# EAGLE design MicroMod-Testing-CarrierBoard (EAGLE 9.5.2)
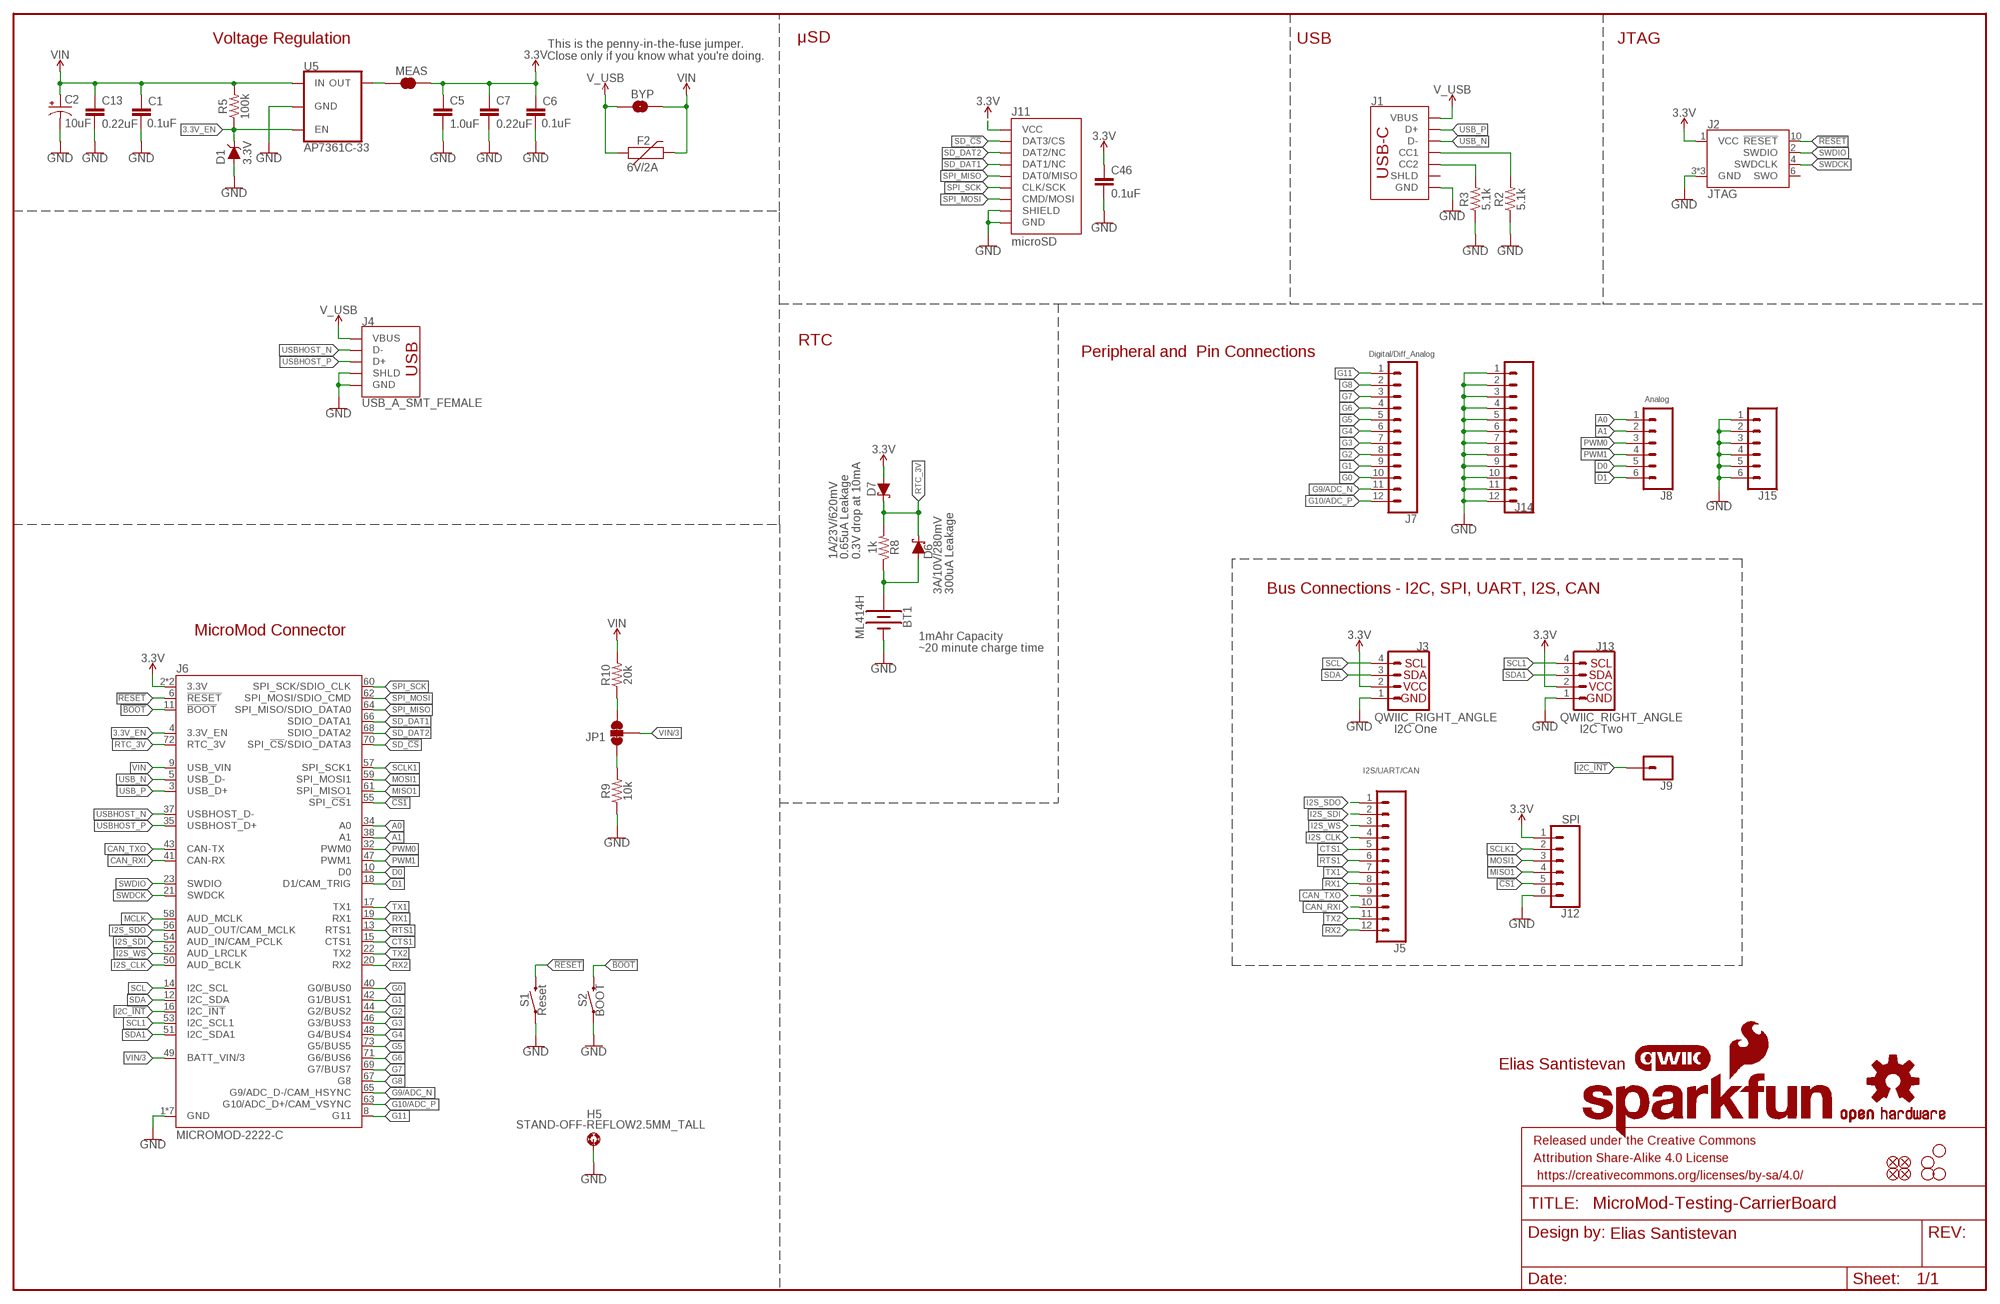
[diagram p0: schematic, sheet 1]

## Parts
BT1  ML414H  ML414H_IV01E_BATTERY  [ML414H_IV01E]
BYP  JUMPER-SMT_2_NO_SILK  [SMT-JUMPER_2_NO_SILK]
C1  0.1uF  0.1UF-0603-25V-(+80/-20%)  [0603]
C2  10uF  10UF-POLAR-EIA3216-16V-10%(TANT)  [EIA3216]
C5  1.0uF  1.0UF-0603-16V-10%  [0603]
C6  0.1uF  0.1UF-0603-25V-(+80/-20%)  [0603]
C7  0.22uF  0.22UF-0603-25V-10%  [0603]
C13  0.22uF  0.22UF-0603-25V-10%  [0603]
C46  0.1uF  0.1UF-0603-25V-(+80/-20%)  [0603]
D1  3.3V  DIODE-ZENER-MM3Z3V3T1G  [SOD-323]
D6  3A/10V/280mV  DIODE-SCHOTTKY-BAT60A  [SOD-323]
D7  1A/23V/620mV  DIODE-SCHOTTKY-BAT20J  [SOD-323]
F2  6V/2A  PPTC_6V2A  [1210]
FD1  FIDUCIALUFIDUCIAL  [FIDUCIAL-MICRO]
FD2  FIDUCIALUFIDUCIAL  [FIDUCIAL-MICRO]
FD3  FIDUCIALUFIDUCIAL  [FIDUCIAL-MICRO]
FD4  FIDUCIALUFIDUCIAL  [FIDUCIAL-MICRO]
FRAME1  FRAME-LEDGER  [CREATIVE_COMMONS]
H1  STAND-OFF  [STAND-OFF]
H2  STAND-OFF  [STAND-OFF]
H3  STAND-OFF  [STAND-OFF]
H4  STAND-OFF  [STAND-OFF]
H5  STAND-OFF-REFLOW2.5MM_TALL  [STAND-OFF-REFLOW-M2.5]
J1  USB_C_2-LAYER_PADS  [USB-C-16P-2LAYER-PADS]
J2  JTAG  CORTEX_JTAG_DEBUG_MINIMUM_PTH  [2X5-PTH-1.27MM]
J3  QWIIC_RIGHT_ANGLE  QWIIC_CONNECTORJS-1MM  [JST04_1MM_RA]
J4  USB_A_SMT_FEMALE  [USB-A-S-SILK-FEMALE]
J5  CONN_12NO_SILK  [1X12_NO_SILK]
J6  MICROMOD-2222-C  [M.2-CONNECTOR-E]
J7  CONN_12NO_SILK  [1X12_NO_SILK]
J8  Dedicated  CONN_06NO_SILK_NO_POP  [1X06_NO_SILK]
J9  CONN_01PTH_NO_SILK_YES_STOP  [1X01_NO_SILK]
J11  microSD  MICRO-SD-SDIOPUSH-PUSH  [MICRO-SD-SOCKET]
J12  SPI  CONN_06NO_SILK_NO_POP  [1X06_NO_SILK]
J13  QWIIC_RIGHT_ANGLE  QWIIC_CONNECTORJS-1MM  [JST04_1MM_RA]
J14  CONN_12NO_SILK  [1X12_NO_SILK]
J15  Dedicated  CONN_06NO_SILK_NO_POP  [1X06_NO_SILK]
JP1  JUMPER-SMT_3_2-NC_TRACE_SILK  [SMT-JUMPER_3_2-NC_TRACE_SILK]
LOGO1  SFE_LOGO_NAME_FLAME.1_INCH  [SFE_LOGO_NAME_FLAME_.1]
LOGO2  QWIIC_LOGO_CONNECTOR  [QWIIC_5.5MM]
LOGO3  OSHW-LOGOMINI  [OSHW-LOGO-MINI]
MEAS  JUMPER-COMBO_2_NC_TRACE  [COMBO-JUMPER_2_NC_TRACE]
R2  5.1k  5.1KOHM5.1KOHM-0603-1/10W-1%  [0603]
R3  5.1k  5.1KOHM5.1KOHM-0603-1/10W-1%  [0603]
R5  100k  100KOHM-0603-1/10W-1%  [0603]
R8  1k  1KOHM-0603-1/10W-1%  [0603]
R9  10k  10KOHM-0603-1/10W-1%  [0603]
R10  20k  20KOHM-0603-1/10W-1%  [0603]
S1  Reset  MOMENTARY-SWITCH-SPST-SMD-5.2-TALL-REDUNDANT  [TACTILE_SWITCH_SMD_5.2MM]
S2  BOOT  MOMENTARY-SWITCH-SPST-SMD-5.2-TALL-REDUNDANT  [TACTILE_SWITCH_SMD_5.2MM]
U5  AP7361C-33  AP7361C-33FGEUDFN-8  [UDFN-8]

## Nets
3.3V: C5.1 C6.1 C7.1 C46.1 D7.A J2.1(VCC) J3.2 J6.2(3.3V) J6.74(3.3V) J11.VCC J12.1 J13.2 MEAS.2 MEAS.4
3.3V_EN: D1.C J6.4(3.3V_EN) R5.1 U5.5(EN)
!BOOT!: J6.11(!BOOT!) S2.3 S2.4
!CS1: J6.55(SPI_!CS!1) J12.5
!RESET!: J2.10(!RESET) J6.6(!RESET!) S1.3 S1.4
A0: J6.34(A0) J8.1
A1: J6.38(A1) J8.2
CAN_RXI: J5.10 J6.41(CAN-RX)
CAN_TXO: J5.9 J6.43(CAN-TX)
CTS1: J5.5 J6.15(CTS1)
D0: J6.10(D0) J8.5
D1: J6.18(D1/CAM_TRIG) J8.6
G0: J6.40(G0/BUS0) J7.10
G1: J6.42(G1/BUS1) J7.9
G2: J6.44(G2/BUS2) J7.8
G3: J6.46(G3/BUS3) J7.7
G4: J6.48(G4/BUS4) J7.6
G5: J6.73(G5/BUS5) J7.5
G6: J6.71(G6/BUS6) J7.4
G7: J6.69(G7/BUS7) J7.3
G8: J6.67(G8) J7.2
G9/ADC_N [Diff pairs]: J6.65(G9/ADC_D-/CAM_HSYNC) J7.11
G10/ADC_P [Diff pairs]: J6.63(G10/ADC_D+/CAM_VSYNC) J7.12
G11: J6.8(G11) J7.1
GND: BT1.- C1.2 C2.- C5.2 C6.2 C7.2 C13.2 C46.2 D1.A H5.1 J1.GND J1.GND2(GND) J2.3(GND) J2.5(GND) J2.9(GND) J3.1 J4.GND J4.SHLD1(SHLD) J4.SHLD2(SHLD) J6.1(GND) J6.7(GND) J6.33(GND) J6.36(GND) J6.39(GND) J6.45(GND) J6.75(GND) J11.CD1(SHIELD) J11.GND J11.GND1(GND) J11.GND3(GND) J12.6 J13.1 J14.1 J14.2 J14.3 J14.4 J14.5 J14.6 J14.7 J14.8 J14.9 J14.10 J14.11 J14.12 J15.1 J15.2 J15.3 J15.4 J15.5 J15.6 R2.1 R3.1 R9.1 S1.1 S1.2 S2.1 S2.2 U5.4(GND) U5.EP(GND)
I2C_!INT: J6.16(I2C_!INT!) J9.1
I2S_CLK: J5.4 J6.50(AUD_BCLK)
I2S_SDI: J5.2 J6.54(AUD_IN/CAM_PCLK)
I2S_SDO: J5.1 J6.56(AUD_OUT/CAM_MCLK)
I2S_WS: J5.3 J6.52(AUD_LRCLK)
MCLK: J6.58(AUD_MCLK)
MISO1: J6.61(SPI_MISO1) J12.4
MOSI1: J6.59(SPI_MOSI1) J12.3
N$2: JP1.3 R10.1
N$3: JP1.1 R9.2
N$10: J1.A5(CC1) R2.2
N$11: J1.B5(CC2) R3.2
N$14: BT1.+ D6.A R8.1
OUT_MEAS: MEAS.1 MEAS.3 U5.1(OUT)
PWM0: J6.32(PWM0) J8.3
PWM1: J6.47(PWM1) J8.4
RTC_3V: D6.C D7.C J6.72(RTC_3V) R8.2
RTS1: J5.6 J6.13(RTS1)
RX1: J5.8 J6.19(RX1)
RX2: J5.12 J6.20(RX2)
SCL: J3.4 J6.14(I2C_SCL)
SCL1: J6.53(I2C_SCL1) J13.4
SCLK1: J6.57(SPI_SCK1) J12.2
SD_!CS!: J6.70(SPI_!CS!/SDIO_DATA3) J11.CS(DAT3/CS)
SD_DAT1: J6.66(SDIO_DATA1) J11.RSV2(DAT1/NC)
SD_DAT2: J6.68(SDIO_DATA2) J11.RSV1(DAT2/NC)
SDA: J3.3 J6.12(I2C_SDA)
SDA1: J6.51(I2C_SDA1) J13.3
SPI_MISO: J6.64(SPI_MISO/SDIO_DATA0) J11.DO(DAT0/MISO)
SPI_MOSI: J6.62(SPI_MOSI/SDIO_CMD) J11.DI(CMD/MOSI)
SPI_SCK: J6.60(SPI_SCK/SDIO_CLK) J11.SCLK(CLK/SCK)
SWDCK: J2.4(SWDCLK) J6.21(SWDCK)
SWDIO: J2.2(SWDIO) J6.23(SWDIO)
TX1: J5.7 J6.17(TX1)
TX2: J5.11 J6.22(TX2)
USB_N [Diff pairs]: J1.A7(D-) J1.B7(D-) J6.5(USB_D-)
USB_P [Diff pairs]: J1.A6(D+) J1.B6(D+) J6.3(USB_D+)
USBHOST_N [Diff pairs]: J4.D- J6.37(USBHOST_D-)
USBHOST_P [Diff pairs]: J4.D+ J6.35(USBHOST_D+)
V_USB: BYP.1 F2.1 J1.VBUS1(VBUS) J1.VBUS2(VBUS) J4.VBUS
VIN: BYP.2 C1.1 C2.+ C13.1 F2.2 J6.9(USB_VIN) R5.2 R10.2 U5.8(IN)
VIN/3: J6.49(BATT_VIN/3) JP1.2
Unconnected: J1.SHLD1(SHLD) J1.SHLD2(SHLD) J1.SHLD3(SHLD) J1.SHLD4(SHLD) J2.6(SWO)

## Notes on the sheet
- Voltage Regulation | μSD | USB | JTAG
- This is the penny-in-the-fuse jumper.
  Close only if you know what you're doing.
- RTC
- Peripheral and  Pin Connections
- Digital/Diff_Analog
- Analog
- 0.65uA Leakage
  0.3V drop at 10mA
- 300uA Leakage | Bus Connections - I2C, SPI, UART, I2S, CAN
- MicroMod Connector
- 1mAhr Capacity
- ~20 minute charge time
- I2C One | I2C Two
- I2S/UART/CAN
- Elias Santistevan
- Elias Santistevan

## Library data of the parts
BT1 = SparkFun-Batteries:ML414H_IV01E_BATTERY: SEIKO ML414H-IV01E Reflowable Lithium Battery ML414H is a rechargeable, coin type battery with features such as Pb-free reflowable (Peak temperature: 260 C) and high temperature heat resistance. Battery Characteristics: 3.1V max voltage Voff is 2V 1mAH 3k series resistor with battery 72 hour charge time from 2.0-3.1V 2.3-2.8V initial charge; PROD_ID: BATT-14267
BYP = SparkFun-Jumpers:JUMPER-SMT_2_NO: Normally open jumper This jumper has two pads in close proximity to each other. Apply solder to close the connection. Round pads are easier to solder for beginners, but are a lot larger. SparkFun Product that uses the round pads: SparkFun EL Sequencer <https://www.sparkfun.com/products/12781>
C1 C6 C46 = SparkFun-Capacitors:0.1UF: 0.1µF ceramic capacitors A capacitor is a passive two-terminal electrical component used to store electrical energy temporarily in an electric field.; PROD_ID: CAP-00810
C2 = SparkFun-Capacitors:10UF-POLAR: 10.0µF polarized capacitors A capacitor is a passive two-terminal electrical component used to store electrical energy temporarily in an electric field.; PROD_ID: CAP-00811
C5 = SparkFun-Capacitors:1.0UF: 1µF ceramic capacitors A capacitor is a passive two-terminal electrical component used to store electrical energy temporarily in an electric field.; PROD_ID: CAP-00868
C7 C13 = SparkFun-Capacitors:0.22UF: 0.22µF ceramic capacitors A capacitor is a passive two-terminal electrical component used to store electrical energy temporarily in an electric field.; PROD_ID: CAP-07822
D1 = SparkFun-DiscreteSemi:DIODE-ZENER: Zener Diode A Zener diode allows current to flow from its anode to its cathode like a normal semiconductor diode, but it also permits current to flow in the reverse direction when its "Zener voltage" is reached. - WIkipedia; PROD_ID: DIO-11284
D6 = SparkFun-DiscreteSemi:DIODE-SCHOTTKY: Schottky diode A Schottky diode is a semiconductor diode which has a low forward voltage drop and a very fast switching action.; PROD_ID: DIO-14072
D7 = SparkFun-DiscreteSemi:DIODE-SCHOTTKY: Schottky diode A Schottky diode is a semiconductor diode which has a low forward voltage drop and a very fast switching action.; PROD_ID: DIO-11623
F2 = SparkFun-Fuses:PPTC: Resettable Fuse PPTC Resettable Fuse. Really a sort of resistor with a polymeric positive temperature coefficient whose resistance increases dramatically with an increase in temperature. When heated by the power passing through the resistance rises causing the current to be limited, protecting the circuit. This is achieved by the transition of the polymer from a crystalline to an amorphous state where the conductive carbon separates breaking the conductive pathways found in the cool crystalline structure. When a PPTC cools back down it resumes conducting letting the circuit turn back on. SparkFun Products: SparkFun RedBoard - Programmed with Arduino <https://www.sparkfun.com/products/12757> Pro Micro - 5V/16MHz <https://www.sparkfun.com/products/12640> Arduino Pro 328 - 5V/16MHz <https://www.sparkfun.com/products/10915> MP3 Trigger <https://www.sparkfun.com/products/13720>; PROD_ID: RES-14313
FD1-FD4 = SparkFun-Aesthetics:FIDUCIAL: Fiducial Alignment Points Point-of-reference for pick-and-place machines and other optical instruments.
FRAME1 = SparkFun-Aesthetics:FRAME-LEDGER: Schematic Frame - Ledger Standard 11x14 US Ledger frame
H1-H4 = SparkFun-Hardware:STAND-OFF: Stand Off Drill holes for mechanically mounting via screws, standoffs, etc. Note: Use the keepout ring to avoid running the screw head into surrounding components. Variant Overviews STAND-OFF - Mechanical footprint for a #4 phillips button head screw. STAND-OFF-TIGHT - Mechanical footprint for a #4 phillips button head screw, Example SparkFun Products Screw - Phillips Head (1/4", 4-40, 10 pack) <https://www.sparkfun.com/products/10453> (PRT-10453) Screw - Phillips Head (1/2", 4-40, 10 pack) <https://www.sparkfun.com/products/10452> (PRT-10452) Screw - Phillips Head (3/4", 4-40, 10 pack) <https://www.sparkfun.com/products/10451> (PRT-10451) Screw - Phillips Head (1", 4-40, 10 pack) <https://www.sparkfun.com/products/10450> (PRT-10450)
H5 = SparkFun-Hardware:STAND-OFF-REFLOW: Stand Off Reflow Compatible A metal standoff that can be placed and reflowed onto a PCB.; PROD_ID: HW-14899
J1 = SparkFun-Connectors:USB_C: USB Type C 16Pin Connector Super Speed pins not available on the 16-pin purely SMD connector so this part is best for USB 2.0 implementations. D1 and D2 are tied together enabling D+/- no matter which way the cable is plugged into the connector. The two channel configuration pins (CC1/2) are exposed. These are normally connected to ground via 5.1k resistors but can be reconfigured for high current/high power applications.; PROD_ID: CONN-14122
J2 = SparkFun-Connectors:CORTEX_JTAG_DEBUG_MINIMUM: Cortex Debug Connector - 10 pin Supports JTAG debug, Serial Wire debug, and Serial Wire Viewer. PTH and SMD connector options available. General Connector Information <http://infocenter.arm.com/help/topic/com.arm.doc.faqs/attached/13634/cortex_debug_connectors.pdf> Products: PTH Connector <http://www.digikey.com/product-detail/en/cnc-tech/3220-10-0100-00/1175-1627-ND/3883661> -via Digi-Key SparkFun PSoc <https://www.sparkfun.com/products/13229> SparkFun T <https://www.sparkfun.com/products/13810>
J3 J13 = SparkFun-Connectors:QWIIC_CONNECTOR: SparkFun I2C Standard Qwiic Connector An SMD 1mm pitch JST connector makes it easy and quick (get it? Qwiic?) to connect I2C devices to each other. The Qwiic system <http://www.sparkfun.com/qwiic> enables fast and solderless connection between popular platforms and various sensors and actuators. We carry 200mm <https://www.sparkfun.com/products/14204>, 100mm <https://www.sparkfun.com/products/14205>, 50mm <https://www.sparkfun.com/products/14206>, and breadboard friendly <https://www.sparkfun.com/products/14207> Qwiic cables. We also offer 10 pcs strips <https://www.sparkfun.com/products/14323> the SMD connectors.; PROD_ID: CONN-13694
J4 = SparkFun-Connectors:USB_A: USB-A Connector Male and female variants, as well as PTH and SMT variants SparkFun Products: SparkFun XBee Explorer Dongle <https://www.sparkfun.com/products/11697> PTH Male SparkFun MicroView-USB Programmer <https://www.sparkfun.com/products/12924> SMT Male SparkFun USB Type A Female Breakout <https://www.sparkfun.com/products/12700> SMT Female; PROD_ID: CONN-09520; SF_ID: PRT-09011
J5 J7 J14 = SparkFun-Connectors:CONN_12: Multi connection point. Often used as Generic Header-pin footprint for 0.1 inch spaced/style header connections On any of the 0.1 inch spaced packages, you can populate with these: Break Away Headers - Straight <https://www.sparkfun.com/products/116> (PRT-00116) Break Away Male Headers - Right Angle <https://www.sparkfun.com/products/553> (PRT-00553) Female Headers <https://www.sparkfun.com/products/115> (PRT-00115) Break Away Headers - Machine Pin <https://www.sparkfun.com/products/117> (PRT-00117) Break Away Female Headers - Swiss Machine Pin <https://www.sparkfun.com/products/743> (PRT-00743) For SCREWTERMINALS and SPRING TERMINALS visit here: Screw Terimnals on SparkFun.com <https://www.sparkfun.com/search/results?term=Screw+Terminals> (5mm/3.5mm/2.54mm spacing) This device is also useful as a general connection point to wire up your design to another part of your project. Our various solder wires solder well into these plated through hole pads. Hook-Up Wire - Assortment (Stranded, 22 AWG) <https://www.sparkfun.com/products/11375> (PRT-11375) Hook-Up Wire - Assortment (Solid Core, 22 AWG) <https://www.sparkfun.com/products/11367> (PRT-11367) View the entire wire category on our website here <https://www.sparkfun.com/categories/141> Special notes: Molex polarized connector foot print use with SKU : PRT-08231 with associated crimp pins and housings. 1MM SMD Version SKU: PRT-10208 NOTES ON THE VARIANTS LOCK and LOCK_LONGPADS... This footprint was designed to help hold the alignment of a through-hole component (i.e. 6-pin header) while soldering it into place. You may notice that each hole has been shifted either up or down by 0.005 of an inch from it's more standard position (which is a perfectly straight line). This slight alteration caused the pins (the squares in the middle) to touch the edges of the holes. Because they are alternating, it causes a "brace" to hold the component in place. 0.005 has proven to be the perfect amount of "off-center" position when using our standard breakaway headers. Although looks a little odd when you look at the bare footprint, once you have a header in there, the alteration is very hard to notice. Also,if you push a header all the way into place, it is covered up entirely on the bottom side.
J6 = SparkFun-MicroMod:MICROMOD: MicroMod Connector Description: A card edge connector and mating PCB connector to allow various MicroMod Processor Boards to be coupled with various carrier boards of different capabilities. Based on the M.2 standard.; PROD_ID: CONN-14877
J8 J12 J15 = SparkFun-Connectors:CONN_06: Multi connection point. Often used as Generic Header-pin footprint for 0.1 inch spaced/style header connections On any of the 0.1 inch spaced packages, you can populate with these: Break Away Headers - Straight <https://www.sparkfun.com/products/116> (PRT-00116) Break Away Male Headers - Right Angle <https://www.sparkfun.com/products/553> (PRT-00553) Female Headers <https://www.sparkfun.com/products/115> (PRT-00115) Break Away Headers - Machine Pin <https://www.sparkfun.com/products/117> (PRT-00117) Break Away Female Headers - Swiss Machine Pin <https://www.sparkfun.com/products/743> (PRT-00743) Arduino Stackable Header - 6 Pin <https://www.sparkfun.com/products/9280> (PRT-09280) For SCREWTERMINALS and SPRING TERMINALS visit here: Screw Terimnals on SparkFun.com <https://www.sparkfun.com/search/results?term=Screw+Terminals> (5mm/3.5mm/2.54mm spacing) This device is also useful as a general connection point to wire up your design to another part of your project. Our various solder wires solder well into these plated through hole pads. Hook-Up Wire - Assortment (Stranded, 22 AWG) <https://www.sparkfun.com/products/11375> (PRT-11375) Hook-Up Wire - Assortment (Solid Core, 22 AWG) <https://www.sparkfun.com/products/11367> (PRT-11367) View the entire wire category on our website here <https://www.sparkfun.com/categories/141>
J9 = SparkFun-Connectors:CONN_01: Single connection point. Often used as Generic Header-pin footprint for 0.1 inch spaced/style header connections On any of the 0.1 inch spaced packages, you can populate with these: Break Away Headers - Straight <https://www.sparkfun.com/products/116> (PRT-00116) Break Away Male Headers - Right Angle <https://www.sparkfun.com/products/553> (PRT-00553) Female Headers <https://www.sparkfun.com/products/115> (PRT-00115) Break Away Headers - Machine Pin <https://www.sparkfun.com/products/117> (PRT-00117) Break Away Female Headers - Swiss Machine Pin <https://www.sparkfun.com/products/743> (PRT-00743) This device is also useful as a general connection point to wire up your design to another part of your project. Our various solder wires solder well into these plated through hole pads. Hook-Up Wire - Assortment (Stranded, 22 AWG) <https://www.sparkfun.com/products/11375> (PRT-11375) Hook-Up Wire - Assortment (Solid Core, 22 AWG) <https://www.sparkfun.com/products/11367> (PRT-11367) View the entire wire category on our website here <https://www.sparkfun.com/categories/141> Special notes: SMTSO-256-ET is a "flush mount" nut for a 4-40 screw. We mostly use this on specialty testbeds; it is a nice way to connect hardware to your PCB at an adjustable hieght. Also note, the SNAP packages are for using a snappable style connector. We sell a baggie of snaps and they are also used on two LilyPad designs: Snap Assortment - 30 pack (male and female) <https://www.sparkfun.com/products/11347> (DEV-11347) LilyPad Arduino SimpleSnap <https://www.sparkfun.com/products/10941> (DEV-10941) LilyPad SimpleSnap Protoboard <https://www.sparkfun.com/products/10940> (DEV-10940)
J11 = SparkFun-Connectors:MICRO-SD-SDIO: microSD Socket for Transflash Push-push type µSD socket. tDoc lines correctly indicate media card edge positions when inserting (unlocked, locked, depressed). NOTE: CD1 and CD2 are connected internally, and the default detect state of the socket is detect pin to ground. SparkFun Products: WAV Trigger <https://www.sparkfun.com/products/13660> CAN-Bus Shield <https://www.sparkfun.com/products/13262> SparkFun Level Shifing microSD Breakout <https://www.sparkfun.com/products/13743>; PROD_ID: CONN-07820
JP1 = SparkFun-Jumpers:JUMPER-SMT_3_2-NC_TRACE: Normally closed trace jumper (2 of 2 connections) This jumper has a trace between all three pads so they are normally closed (NC). Use a razor knife to open the connection(s). For best results follow the IPC guidelines for cutting traces: Cutout at least 0.063 mm (0.005 in). Remove all loose material to clean up the cut area. Seal the cut with an approved epoxy. Reapply solder to reclose the connection(s).
LOGO1 = SparkFun-Aesthetics:SFE_LOGO_NAME_FLAME: SparkFun Font Logo w/ Flame This is the SparkFun full logo. The logo on the schematic will always be the same size; the package variant is the height of the flame part of the logo. Default layer for the logo on the board is tSilk.
LOGO2 = SparkFun-Aesthetics:QWIIC_LOGO: Qwiic Logos for placement on schematic and PCB. The 5.5mm silk logo is best for placing next to Qwiic connector.
LOGO3 = SparkFun-Aesthetics:OSHW-LOGO: Open-Source Hardware (OSHW) Logo This logo indicates the piece of hardware it is found on incorporates a OSHW license and/or adheres to the definition of open source hardware found here: http://freedomdefined.org/OSHW
MEAS = SparkFun-Jumpers:JUMPER-COMBO_2_NC_TRACE
R2 R3 = SparkFun-Resistors:5.1KOHM; PROD_ID: RES-12083
R5 = SparkFun-Resistors:100KOHM: 100kΩ resistor A resistor is a passive two-terminal electrical component that implements electrical resistance as a circuit element. Resistors act to reduce current flow, and, at the same time, act to lower voltage levels within circuits. - Wikipedia; PROD_ID: RES-07828
R8 = SparkFun-Resistors:1KOHM: 1kΩ resistor A resistor is a passive two-terminal electrical component that implements electrical resistance as a circuit element. Resistors act to reduce current flow, and, at the same time, act to lower voltage levels within circuits. - Wikipedia; PROD_ID: RES-07856
R9 = SparkFun-Resistors:10KOHM: 10kΩ resistor A resistor is a passive two-terminal electrical component that implements electrical resistance as a circuit element. Resistors act to reduce current flow, and, at the same time, act to lower voltage levels within circuits. - Wikipedia; PROD_ID: RES-00824
R10 = SparkFun-Resistors:20KOHM: 20kΩ resistor A resistor is a passive two-terminal electrical component that implements electrical resistance as a circuit element. Resistors act to reduce current flow, and, at the same time, act to lower voltage levels within circuits. - Wikipedia; PROD_ID: RES-09383
S1 S2 = SparkFun-Switches:MOMENTARY-SWITCH-SPST: Momentary Switch (Pushbutton) - SPST Normally-open (NO) SPST momentary switches (buttons, pushbuttons). Variants PTH-12MM - 12mm square, through-hole Momentary Pushbutton Switch - 12mm Square <https://www.sparkfun.com/products/9190> (COM-09190) PTH-6.0MM, PTH-6.0MM-KIT - 6.0mm square, through-hole Mini Pushbutton Switch <https://www.sparkfun.com/products/97> (COM-00097) KIT package intended for soldering kit's - only one side of pads' copper is exposed. PTH-RIGHT-ANGLE-KIT - Right-angle, through-hole Right Angle Tactile Button <https://www.sparkfun.com/products/10791> - Used on SparkFun BigTime Watch Kit <https://www.sparkfun.com/products/11734> SMD-12MM - 12mm square, surface-mount Tactile Button - SMD (12mm) <https://www.sparkfun.com/products/12993> (COM-12993) Used on SparkFun PicoBoard <https://www.sparkfun.com/products/11888> SMD-4.5MM - 4.5mm Square Trackball Switch Used on SparkFun Blackberry Trackballer Breakout <https://www.sparkfun.com/products/13169> SMD-4.6MMX2.8MM - 4.60mm x 2.80mm, surface mount Used on SparkFun SAMD21 Mini Breakout <https://www.sparkfun.com/products/13664> SMD-5.2MM, SMD-5.2-REDUNDANT - 5.2mm square, surface-mount Mini Pushbutton Switch - SMD <https://www.sparkfun.com/products/8720> (COM-08720) Used on Arduino Pro Mini <https://www.sparkfun.com/products/11114> REDUNDANT package connects both switch circuits together SMD-6.0X3.5MM - 6.0 x 3.5mm, surface mount Momentary Reset Switch SMD <https://www.sparkfun.com/products/8229> (COM-08229) SMD-6.2MM-TALL - 6.2mm square, surface mount Tactile Button - SMD (6mm) <https://www.sparkfun.com/products/12992> Used on SparkFun Digital Sandbox <https://www.sparkfun.com/products/12651> SMD-RIGHT-ANGLE - Right-angle, surface mount Used on SparkFun Block for Intel® Edison - Arduino <https://www.sparkfun.com/products/13036>; PROD_ID: SWCH-14139
U5 = SparkFun-IC-Power:AP7361C-33FGE: AP7361C 3.3V LDO Regulator; PROD_ID: VREG-14094

## Net classes
0 default: width 0 mm, drill 0 mm
1 power: width 0.762 mm

## Board
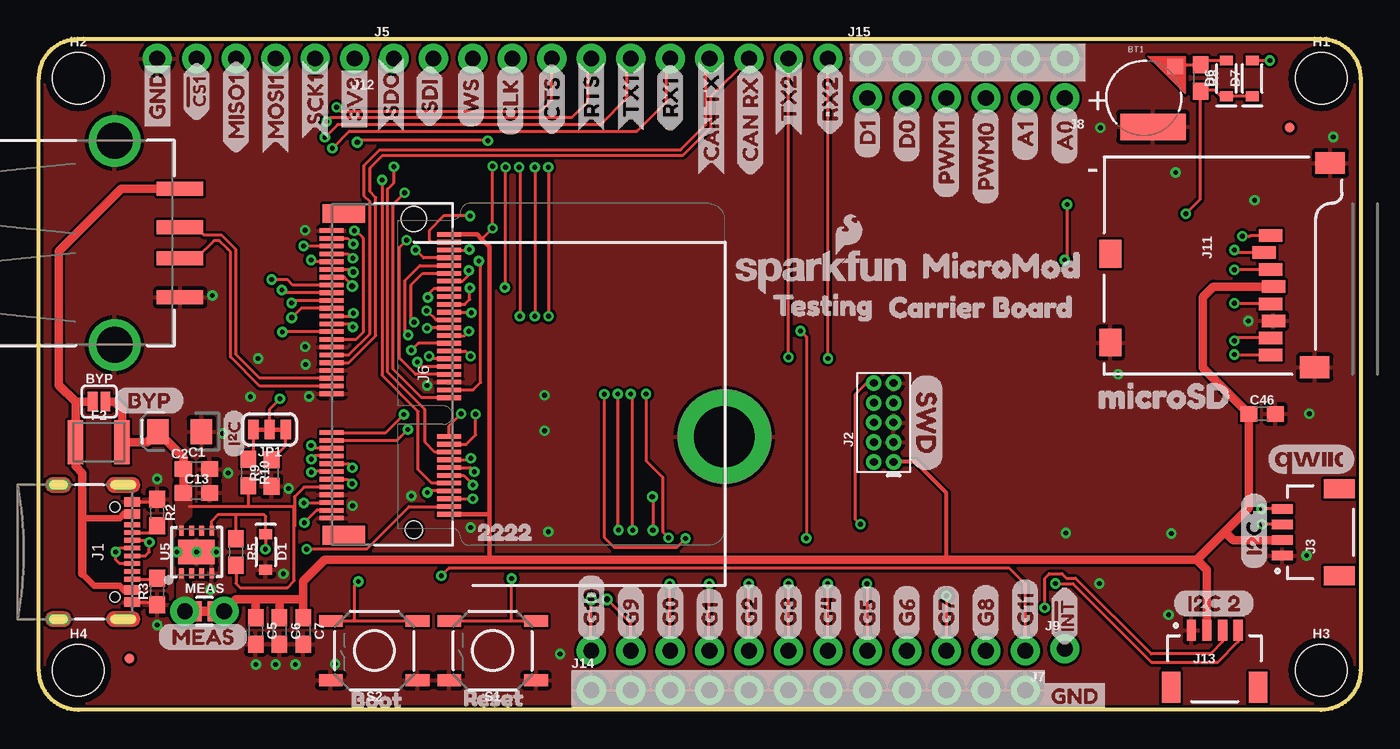
[diagram p1: board, top side]
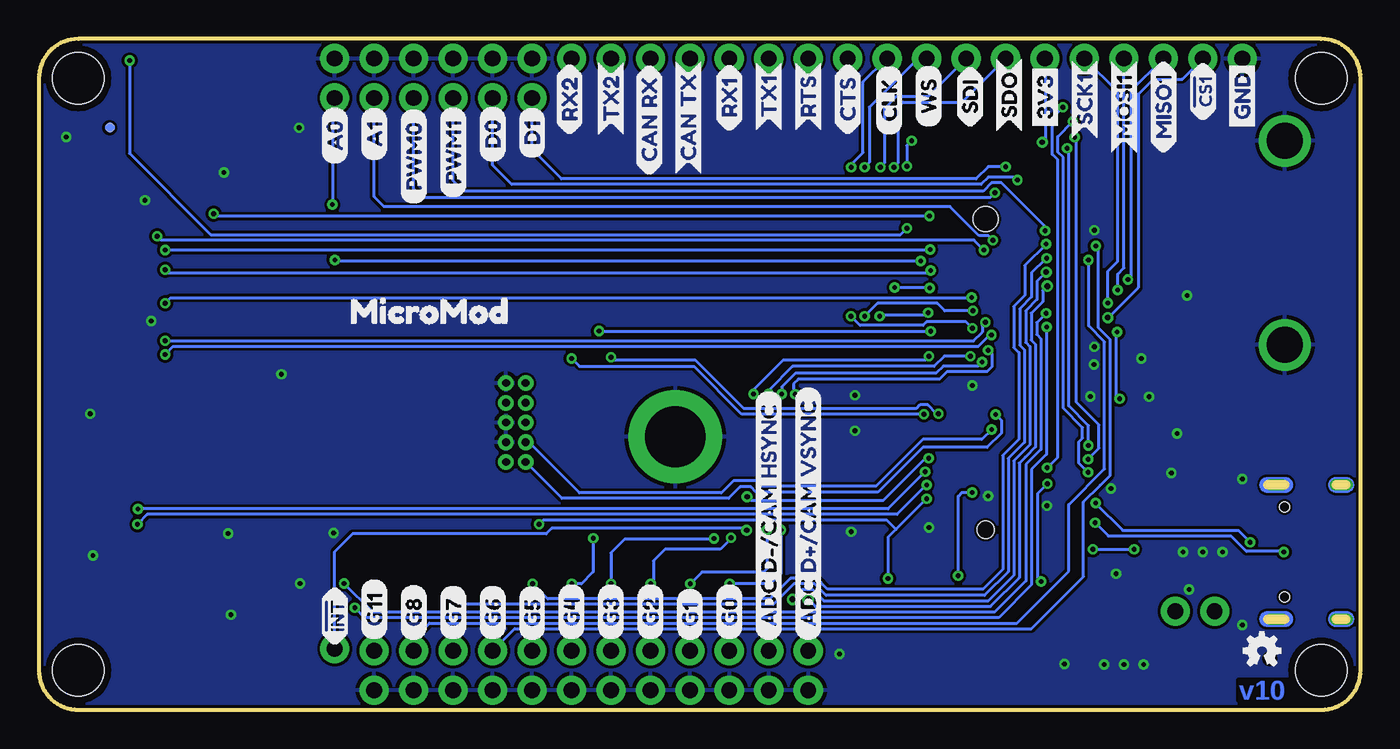
[diagram p2: board, bottom side, seen from below]

Size 85.09 x 43.18 mm. Coordinates in mm from the lower left corner, seen from the top.
Outline: 85.09,40.64 85.09,2.54 arc-90 82.55,0 2.54,0 arc-90 0,2.54 0,40.64 arc-90 2.54,43.18 82.55,43.18 arc-90 85.09,40.64
Copper layers (1*16): Top 0.035mm / dielectric 1.5mm / Bottom 0.035mm
Design rules "SparkFun-2-layer-TIGHT *": minimum track width 7mil, minimum drill 12mil, track to track 7mil, track to pad 7mil, pad to pad 7mil, via to via 7mil, smd to smd 7mil, copper to edge 7mil, drill to drill 7mil, minimum pad ring 7mil, minimum via ring 7mil, stop-mask expansion 4mil, vias tented up to drill 25mil, thermal gap 10mil

### Footprints (pad centres in the part's own frame; a part is rotated, then mirrored left to right if it is on the bottom)
ML414H_IV01E = smd 1 x 1: + 2.022,2.032 | smd 4.2 x 1.7: - 0.6,-1.85
SMT-JUMPER_2_NO_SILK = smd 0.635 x 1.27: 1 -0.406,0; 2 0.406,0
0603 = smd 1.1 x 1: 1 -0.85,0; 2 0.85,0
EIA3216 = smd 1.4 x 1.6: + 1.4,0; - -1.4,0
SOD-323 = smd 0.63 x 0.83: A 1.15,0; C -1.15,0
1210 = smd 1 x 2.8: 1 -1.5,0; 2 1.5,0
FIDUCIAL-MICRO = smd 0.635 x 0.635: 1 0,0
STAND-OFF = hole 3.302: 0,0
STAND-OFF-REFLOW-M2.5 = drill 3.9 pad 6: 1 0,0
USB-C-16P-2LAYER-PADS = smd 0.3 x 1: A5 -1.25,-0.34; A6 -0.25,-0.34; A7 0.25,-0.34; A8 1.25,-0.34; B5 1.75,-0.34; B6 0.75,-0.34; B7 -0.75,-0.34; B8 -1.75,-0.34 | smd 0.6 x 1: GND -3.225,-0.34; GND2 3.225,-0.34; VBUS1 -2.45,-0.34; VBUS2 2.45,-0.34 | drill 0.4 pad 0.6 long: SHLD1 -4.318,-0.915; SHLD2 4.318,-0.915; SHLD3 -4.318,-5.095; SHLD4 4.318,-5.095 | hole 0.65: -2.89,-1.445; 2.89,-1.445
2X5-PTH-1.27MM = drill 0.508 pad 1: 1 -2.54,-0.635; 2 -2.54,0.635; 3 -1.27,-0.635; 4 -1.27,0.635; 5 0,-0.635; 6 0,0.635; 7 1.27,-0.635; 8 1.27,0.635; 9 2.54,-0.635; 10 2.54,0.635
JST04_1MM_RA = smd 0.6 x 1.35: 1 -1.5,0; 2 -0.5,0; 3 0.5,0; 4 1.5,0 | smd 1.2 x 2: NC1 2.8,-3.675; NC2 -2.8,-3.675
USB-A-S-SILK-FEMALE = smd 3 x 0.9: D+ 7.212,-1; D- 7.212,1; GND 7.212,-3.5; VBUS 7.212,3.5 | drill 2.311: SHLD1 3,-6.566; SHLD2 3,6.566
1X12_NO_SILK = drill 1.016 pad 1.88: 1 0,0; 2 2.54,0; 3 5.08,0; 4 7.62,0; 5 10.16,0; 6 12.7,0; 7 15.24,0; 8 17.78,0; 9 20.32,0; 10 22.86,0; 11 25.4,0; 12 27.94,0
M.2-CONNECTOR-E = smd 0.3 x 1.55: 1 9.25,-5.275; 2 9,2.275; 3 8.75,-5.275; 4 8.5,2.275; 5 8.25,-5.275; 6 8,2.275; 7 7.75,-5.275; 8 7.5,2.275; 9 7.25,-5.275; 10 7,2.275; 11 6.75,-5.275; 12 6.5,2.275; 13 6.25,-5.275; 14 6,2.275; 15 5.75,-5.275; 16 5.5,2.275; 17 5.25,-5.275; 18 5,2.275; 19 4.75,-5.275; 20 4.5,2.275; 21 4.25,-5.275; 22 4,2.275; 23 3.75,-5.275; 32 1.5,2.275; 33 1.25,-5.275; 34 1,2.275; 35 0.75,-5.275; 36 0.5,2.275; 37 0.25,-5.275; 38 0,2.275; 39 -0.25,-5.275; 40 -0.5,2.275; 41 -0.75,-5.275; 42 -1,2.275; 43 -1.25,-5.275; 44 -1.5,2.275; 45 -1.75,-5.275; 46 -2,2.275; 47 -2.25,-5.275; 48 -2.5,2.275; 49 -2.75,-5.275; 50 -3,2.275; 51 -3.25,-5.275; 52 -3.5,2.275; 53 -3.75,-5.275; 54 -4,2.275; 55 -4.25,-5.275; 56 -4.5,2.275; 57 -4.75,-5.275; 58 -5,2.275; 59 -5.25,-5.275; 60 -5.5,2.275; 61 -5.75,-5.275; 62 -6,2.275; 63 -6.25,-5.275; 64 -6.5,2.275; 65 -6.75,-5.275; 66 -7,2.275; 67 -7.25,-5.275; 68 -7.5,2.275; 69 -7.75,-5.275; 70 -8,2.275; 71 -8.25,-5.275; 72 -8.5,2.275; 73 -8.75,-5.275; 74 -9,2.275; 75 -9.25,-5.275 | smd 1.2 x 2.75: A1 10.35,-4.5; A2 -10.35,-4.5 | hole 1.1: 10,0 | hole 1.6: -10,0
1X06_NO_SILK = drill 1.016 pad 1.88: 1 0,0; 2 2.54,0; 3 5.08,0; 4 7.62,0; 5 10.16,0; 6 12.7,0
1X01_NO_SILK = drill 1.016 pad 1.88: 1 0,0
MICRO-SD-SOCKET = smd 1.8 x 1.4: CD1 -2.05,0.4; CD2 -7.75,0.4 | smd 0.8 x 1.5: CS -7.84,10.3; DI -6.74,10.7; DO -2.34,10.7; GND -3.44,10.9; RSV1 -8.94,10.7; RSV2 -1.24,10.7; SCLK -4.54,10.7; VCC -5.64,10.9 | smd 1.4 x 1.9: GND1 -13.6,14.55; GND3 -0.45,13.55
SMT-JUMPER_3_2-NC_TRACE_SILK = smd 0.66 x 1.27: 1 -1.041,0; 2 0,0; 3 1.041,0
COMBO-JUMPER_2_NC_TRACE = smd 0.635 x 1.27: 1 -0.508,0; 2 0.508,0 | drill 1.016 pad 1.88: 3 -1.27,0; 4 1.27,0
TACTILE_SWITCH_SMD_5.2MM = smd 1.524 x 0.762: 1 -2.794,1.905; 2 2.794,1.905; 3 -2.794,-1.905; 4 2.794,-1.905
UDFN-8 = smd 0.3 x 0.65: 1 -0.975,-1.375; 2 -0.325,-1.375; 3 0.325,-1.375; 4 0.975,-1.375; 5 0.975,1.375; 6 0.325,1.375; 7 -0.325,1.375; 8 -0.975,1.375 | smd 2.35 x 1.6: EP 0,0

### Placement (x,y rotation side)
BT1  71.12,39.37 0 top
BYP  3.89,19.84 0 top
C1  10.16,15.49 0 top
C2  9.07,17.91 180 top
C5  13.97,5.08 270 top
C6  15.49,5.08 270 top
C7  17.02,5.08 270 top
C13  10.16,13.97 0 top
C46  78.74,19.05 0 top
D1  14.61,10.16 270 top
D6  76.45,40.64 90 top
D7  78.11,40.64 90 top
F2  3.86,17.22 0 top
FD1  5.84,3.3 0 top
FD2  80.52,37.47 0 top
FD3  5.84,3.3 0 bottom
FD4  80.52,37.47 0 bottom
FRAME1  20.57,-10.67 0 top  (outside the outline)
H1  82.55,40.64 0 top
H2  2.54,40.64 0 top
H3  82.55,2.54 0 top
H4  2.54,2.54 0 top
H5  44.12,17.58 0 top
J1  6.35,10.16 270 top
J2  54.38,18.49 90 top
J3  80.04,11.43 90 top
J4  1.88,30.05 0 top
J5  22.86,41.91 0 top
J6  24.13,21.59 270 top
J7  63.5,3.81 180 top
J8  66.04,39.37 180 top
J9  66.04,3.94 0 top
J11  68.58,21.59 270 top
J12  20.32,41.91 180 top
J13  75.69,5.13 0 top
J14  35.56,1.27 0 top
J15  53.34,41.91 0 top
JP1  14.86,18.03 180 top
LOGO1  50.42,28.19 0 top
LOGO2  81.92,16.13 0 top
LOGO3  6.35,3.81 0 bottom
MEAS  10.67,6.35 0 top
R2  7.62,12.7 270 top
R3  7.62,7.62 90 top
R5  12.7,10.16 270 top
R8  74.78,40.67 270 top
R9  14.99,15.24 90 top
R10  13.49,15.27 270 top
S1  29.21,3.81 180 top
S2  21.59,3.81 180 top
U5  10.16,10.16 0 top
U$1  [G00]  40.64,4.45 90 top
U$2  [RESET3]  26.42,0.76 0 top
U$3  [G11]  43.18,4.45 90 top
U$4  [G22]  45.72,4.45 90 top
U$5  [MEAS]  7.62,4.7 0 top
U$6  [GND_P]  7.62,37.08 90 top
U$7  [ADC_D##CAM_HSYNC0]  38.1,4.45 90 bottom
U$8  [ADC_D##CAM_VSYNC1]  35.56,4.45 90 bottom
U$9  [#CS13]  10.16,37.72 90 top
U$10  [MISO10]  12.7,35.81 90 top
U$11  [G33]  48.26,4.45 90 top
U$12  [D13]  53.34,35.43 90 top
U$13  [D13]  53.34,35.43 90 bottom
U$14  [D02]  55.88,35.18 90 top
U$15  [PWM10]  58.42,32.89 90 top
U$16  [D02]  55.88,35.18 90 bottom
U$17  [G44]  50.8,4.45 90 top
U$18  [G55]  53.34,4.45 90 top
U$19  [BOOT2]  19.18,0.64 0 top
U$20  [G66]  55.88,4.45 90 top
U$21  [!INT_I]  66.04,3.94 90 top
U$22  [G77]  58.42,4.45 90 top
U$23  [3V3_P]  20.32,37.08 90 bottom
U$24  [MICROMOD0]  55.5,28.57 0 top
U$25  [RX10]  40.64,37.21 90 bottom
U$26  [3V3_P]  20.32,36.96 90 top
U$27  [BYP]  4.8,19.91 0 top
U$28  [MICROSD4]  66.8,20.19 0 top
U$29  [RX10]  40.64,37.21 90 top
U$30  [G118]  63.5,4.45 90 top
U$31  [TX13]  38.1,37.21 90 top
U$32  [G811]  60.96,4.45 90 top
U$33  [G1010]  35.56,4.45 90 top
U$34  [CAN_RX2]  45.8,34.34 90 top
U$35  [!INT_I]  66.04,3.94 90 bottom
U$36  [CAN_TX3]  43.28,34.39 90 top
U$37  [CLK3]  30.35,36.96 90 top
U$38  [SDI1]  25.15,37.47 90 top
U$39  [SDO0]  22.66,37.21 90 top
U$40  [WS2]  27.81,37.47 90 top
U$41  [TX13]  38.1,37.21 90 bottom
U$42  [I2C_32]  12.57,16.26 90 top
U$43  [A00]  66.04,35.05 90 top
U$44  [A00]  66.04,35.05 90 bottom
U$45  [CARRIER_BOARD0]  53.59,25.91 0 top
U$46  [TESTING0]  46.15,26.04 0 top
U$47  [SWD0]  57.15,21.67 270 top
U$48  [CAN_RX2]  45.8,34.34 90 bottom
U$49  [MOSI11]  15.24,35.81 90 top
U$50  [SCK12]  17.78,36.7 90 top
U$51  [CTS0]  33.02,36.96 90 top
U$52  [RTS1]  35.56,37.21 90 top
U$53  [GND_P]  7.62,37.08 90 bottom
U$54  [CAN_TX3]  43.28,34.42 90 bottom
U$55  [22229]  27.3,11.43 0 top
U$56  [G90]  38.1,4.45 90 top
U$57  [A10]  63.5,35.31 90 top
U$58  [A10]  63.5,35.31 90 bottom
U$59  [PWM01]  60.96,32.51 90 top
U$60  [PWM01]  60.96,32.51 90 bottom
U$61  [PWM10]  58.42,32.89 90 bottom
U$62  [CLK3]  30.35,36.96 90 bottom
U$63  [SDI1]  25.15,37.44 90 bottom
U$64  [MICROMOD0]  66.42,25.65 0 bottom
U$65  [SDO0]  22.63,37.19 90 bottom
U$66  [WS2]  27.81,37.47 90 bottom
U$67  [I2C_10]  78.23,9.02 90 top
U$68  [I2C_21]  73.03,6.86 0 top
U$69  [RX23]  50.93,36.96 90 top
U$70  [RX23]  50.93,36.96 90 bottom
U$71  [TX22]  48.26,36.96 90 bottom
U$72  [TX22]  48.26,36.96 90 top
U$73  [GND_P]  64.26,0.89 0 top
U$74  [#CS13]  10.16,37.72 90 bottom
U$75  [MISO10]  12.7,35.81 90 bottom
U$76  [MOSI11]  15.24,35.81 90 bottom
U$77  [SCK12]  17.78,36.7 90 bottom
U$78  [CTS0]  33.02,36.96 90 bottom
U$79  [RTS1]  35.56,37.21 90 bottom
U$80  [G118]  63.5,4.45 90 bottom
U$81  [G811]  60.96,4.45 90 bottom
U$82  [G77]  58.42,4.45 90 bottom
U$83  [G66]  55.88,4.45 90 bottom
U$84  [G55]  53.34,4.45 90 bottom
U$85  [G44]  50.8,4.45 90 bottom
U$86  [G33]  48.26,4.45 90 bottom
U$87  [G22]  45.72,4.45 90 bottom
U$88  [G11]  43.18,4.45 90 bottom
U$89  [G00]  40.64,4.45 90 bottom

### Tracks (layer width: path | path; a pad name or v marks a point on that pad's centre or on a via)
3.3V  (via drill 0.3, 0.35)
  Top 0.178: MEAS.4 MEAS.2 | D7.A v79.24,41.79 v79.25,41.78 | 28.51,30.29 v29.21,30.99 v29.21,34.98 | v28.91,36.63 28.88,36.65 20.62,36.65 v20.5,36.52
  Top 0.254: 58.42,9.65 58.42,13.97 56.44,15.95 J2.1
  Top 0.305: 29.01,12.57 29.01,29.79 28.51,30.29 28.21,30.59 J6.74 | 29.01,12.57 29.01,9.7 28.96,9.65 | 29.01,12.57 28.99,12.59 J6.2
  Top 0.559: 13.97,7.11 12.7,7.11 MEAS.4 | 13.97,7.11 15.49,7.11 | 15.49,7.11 17.02,7.11 | 74.55,9.65 58.42,9.65 28.96,9.65 18.4,9.65 17.02,8.27 17.02,7.11 | C5.1 13.97,7.11 | C6.1 15.49,7.11 | C7.1 17.02,7.11 | J13.2 75.19,9.01 74.55,9.65 | 74.55,9.65 76.35,11.46 | 76.35,11.46 77.89,12.99 C46.1 74.93,22.01 74.93,26.54 75.62,27.23 J11.VCC | J3.2 76.88,10.93 76.35,11.46
  Bottom 0.178: v79.25,41.78 79.25,35.81 74.02,30.58 29.62,30.58 v29.21,30.99 | J12.1 20.3,41.88 20.3,36.73 v20.5,36.52 | v28.91,36.63 29.21,36.32 v29.21,34.98
3.3V_EN  (via drill 0.3)
  Top 0.178: U5.5 11.13,12.15 11.56,12.57 12.7,12.57 | 12.7,12.57 14.48,12.57 14.61,12.45 D1.C 14.61,10.36 v14.58,10.34 | R5.1 12.7,12.57 | J6.4 23.82,13.08 21.09,10.35 17.33,10.35 17.32,10.34 v17.25,10.34
  Bottom 0.178: v17.25,10.34 v14.58,10.34
!BOOT!  (via drill 0.3)
  Top 0.178: v20.17,14.55 19.88,14.84 J6.11 | S2.3 20.32,5.71 | 20.32,5.71 S2.4 | 20.32,5.71 20.32,8 v20.57,8.26
  Bottom 0.178: v20.17,14.55 20.8,13.92 20.8,8.48 v20.57,8.26
!CS1  (via drill 0.35)
  Top 0.178: J6.55 16.87,25.84 v16.28,25.25
  Bottom 0.178: v16.28,25.25 16.26,25.25 14.33,27.18 14.33,39.62 13.36,40.59 11.48,40.59 J12.5
!RESET!  (via drill 0.3)
  Top 0.178: v27.94,13.59 J6.6 | S1.3 30.43,5.71 | 30.43,5.71 S1.4 | v52.88,11.94 52.58,12.24 52.58,20.32 53.29,21.03 J2.10 | 30.43,5.71 v30.43,8.46
  Bottom 0.178: 29.91,11.62 30.43,11.1 v30.43,8.46 | 29.91,11.62 v27.94,13.59 | 29.91,11.62 30.48,12.19 52.63,12.19 v52.88,11.94
A0  (via drill 0.3)
  Top 0.178: J6.34 27.96,20.59 28.45,21.08 28.45,28.75 v28.32,28.88 | v66.19,32.51 66.19,29.11 v66.04,28.96
  Bottom 0.178: v28.32,28.88 65.96,28.88 v66.04,28.96 | J8.1 66.19,39.22 v66.19,32.51
A1  (via drill 0.3)
  Top 0.178: v23.67,30.23 23.18,29.73 23.18,22.66 24.24,21.59 J6.38
  Bottom 0.178: v23.67,30.23 23.97,30.52 24.57,30.52 26.43,32.38 62.87,32.38 63.5,33.02 J8.2
CAN_RXI
  Top 0.178: J6.41 19.95,22.34 21.69,24.08 21.69,32.97 21.34,33.33 21.34,34.88 22.13,35.67 41.46,35.67 43.28,37.49 43.28,39.47 J5.10
CAN_TXO
  Top 0.178: J6.43 19.94,22.84 21.31,24.21 21.31,32.69 20.95,33.05 20.95,35.05 21.93,36.03 41.31,36.03 42.93,37.64 42.93,41.66 J5.9
CTS1  (via drill 0.3)
  Top 0.178: J6.15 19.91,15.84 v20.18,15.58 | v19.16,38.77 19.44,38.49 32.27,38.49 33.02,39.24 J5.5
  Bottom 0.178: v20.18,15.58 19.51,16.25 19.51,35.41 19.85,35.75 19.85,38.09 v19.16,38.77
D0  (via drill 0.3)
  Top 0.178: v22.1,34.09 22.08,34.08 22.08,21.53 24.42,19.2 24.42,15.46 25.29,14.59 J6.10
  Bottom 0.178: v22.1,34.09 22.3,34.29 23.97,34.29 24.44,33.82 54.65,33.82 55.88,35.05 J8.5
D1  (via drill 0.3)
  Top 0.178: v22.86,34.95 22.86,33.93 22.44,33.51 22.44,21.73 24.85,19.32 24.85,17.23 25.49,16.59 J6.18
  Bottom 0.178: v22.86,34.95 23.98,34.95 24.75,34.18 51.45,34.18 53.34,36.07 J8.6
G0  (via drill 0.3)
  Top 0.178: J6.40 24.65,22.09 v24.36,22.38 | v37.26,20.33 37.26,11.63 v37.31,11.58 | J7.10 40.62,3.83 v40.62,8.12
  Bottom 0.178: v24.36,22.38 24.61,22.12 26.87,22.12 27.33,21.67 36.37,21.67 37.26,20.78 v37.26,20.33 | v40.62,8.12 37.99,8.12 37.33,8.77 37.33,11.56 v37.31,11.58
G1  (via drill 0.3)
  Top 0.178: J6.42 25.29,22.59 v25.12,22.76 | v38.1,20.33 38.23,20.21 v38.23,11.56 | J7.9 43.16,3.83 v43.16,8.12
  Bottom 0.178: v25.12,22.76 26.8,22.76 27.46,22.1 36.58,22.1 38.1,20.57 v38.1,20.33 | v38.23,11.56 38.23,9.09 38.46,8.87 42.41,8.87 v43.16,8.12
G2  (via drill 0.3)
  Top 0.178: J6.44 27.46,23.09 v27.79,22.76 | v39.09,20.33 39.09,16.04 40.16,14.97 40.16,11.46 v40.54,11.07 | J7.8 45.7,3.83 v45.7,8.12
  Bottom 0.178: v27.79,22.76 28.02,22.53 37.16,22.53 39.09,20.6 v39.09,20.33 | v45.7,8.12 45.53,8.28 45.53,9.59 44.78,10.34 41.22,10.34 40.54,11.02 v40.54,11.07
G3  (via drill 0.3)
  Top 0.178: J6.46 24.43,23.59 v23.98,23.14 | v36.4,20.31 36.4,11.1 37.06,10.44 41.05,10.44 v41.63,11.02 | J7.7 v48.26,8.12
  Bottom 0.178: v23.98,23.14 23.75,22.91 23.75,22.07 24.05,21.77 26.62,21.77 27.1,21.29 36.2,21.29 36.5,20.98 36.5,20.41 v36.4,20.31 | v48.26,8.12 48.26,10.11 47.4,10.97 41.63,10.97 v41.63,11.02
G4  (via drill 0.3)
  Top 0.178: J6.48 27.42,24.09 v27.69,24.36 | v49.02,24.38 49.4,24 v49.4,11.05 | J7.6 50.8,8.09 v50.77,8.12
  Bottom 0.178: v27.69,24.36 49,24.36 v49.02,24.38 | v49.4,11.05 49.4,8.88 50.16,8.12 v50.77,8.12
G5  (via drill 0.3)
  Top 0.178: J6.73 19.88,30.34 v20.24,29.97 | J7.5 53.34,8.09 v53.31,8.12
  Bottom 0.178: v20.24,29.97 21.61,28.6 21.61,26.67 22.33,25.96 22.33,23.32 22,22.99 22,17.42 23.04,16.38 23.04,9.04 24.31,7.77 34.32,7.77 35,8.46 36.7,8.46 38.02,7.14 52.34,7.14 v53.31,8.12
G6  (via drill 0.3)
  Top 0.178: J6.71 v17.05,29.84 v17.04,29.84
  Bottom 0.178: J7.4 54.46,5.23 21.18,5.23 17.84,8.57 17.84,13.38 16.76,14.46 16.13,15.09 16.13,23.83 16.9,24.61 16.9,29.7 v17.04,29.84
G7  (via drill 0.3)
  Top 0.178: J6.69 19.94,29.34 v20.22,29.06 | v58.42,7.34 J7.3
  Bottom 0.178: v20.22,29.06 20.24,29.06 21.18,28.12 21.18,26.57 21.95,25.81 21.95,23.47 21.64,23.16 21.64,17.22 22.68,16.18 22.68,8.89 24.21,7.37 34.41,7.37 35.15,8.1 36.48,8.1 37.8,6.78 57.86,6.78 v58.42,7.34
G8  (via drill 0.3)
  Top 0.178: J6.67 17.64,28.84 v17.53,28.96
  Bottom 0.178: J7.2 60.96,4.57 59.94,5.59 22.13,5.59 18.8,8.92 18.8,13.2 16.48,15.51 16.48,23.69 17.51,24.71 17.51,28.94 v17.53,28.96
G9/ADC_N  (via drill 0.35, 0.38)
  Top 0.178: J6.65 20.07,28.34 v20.24,28.17 | J7.11 38.1,5.59 v36.58,7.11
  Bottom 0.178: v20.24,28.17 20.83,27.58 20.83,26.42 21.57,25.68 21.57,23.65 21.29,23.37 21.29,17.07 22.33,16.03 22.33,8.66 23.98,7.01 34.56,7.01 35.3,7.75 35.94,7.75 v36.58,7.11
G10/ADC_P  (via drill 0.38)
  Top 0.178: J6.63 19.66,27.84 20.18,27.32 v20.18,27.27 | J7.12 v35.56,7.11
  Bottom 0.178: v20.18,27.27 20.47,26.97 20.47,26.27 21.21,25.53 21.21,23.8 20.93,23.52 20.93,16.92 21.59,16.26 21.59,16.25 21.97,15.87 21.97,8.51 23.83,6.66 35.1,6.66 v35.56,7.11
G11  (via drill 0.3)
  Top 0.178: J7.1 63.5,8.09 62.48,9.11 26.38,9.11 v25.91,8.64 | v25.01,13.99 25.13,14.11 26.39,14.11 J6.8
  Bottom 0.178: v25.91,8.64 25.91,13.76 25.67,13.99 v25.01,13.99
GND  (via drill 0.3)
  Top 0.178: J1.GND 7.46,13.38 R2.1 | J1.GND2 7.46,6.93 R3.1
  other vias: 7.62,5.46 11.05,7.75 10.16,10.16 11.43,10.16 8.89,10.16 15.75,8.76 20.19,13.13 13.97,2.92 15.24,2.92 16.51,2.92 16.08,14.25 12.19,15.24 11.81,17.78 7.62,14.86 17.14,30.86 11.18,26.67 17.17,22.23 17.14,23.37 17.4,20.17 81.79,19.05 77.85,25.02 69.47,21.59 68.33,37.47 68.28,8.13 72.72,6.12 72.9,11.35 66.12,11.38 24.99,20.88 27.79,11.73 23.98,13.77 32.79,11.46 32.56,17.97 33.55,3.59 19.07,2.96 83.33,36.86 14.12,22.61 13.61,20.14 32.56,20.25 81.61,9.93 78.25,32.8 73.17,34.58
  pour Bottom (isolate 0.178): 0,43.18 85.09,43.18 85.09,0 0,0
  pour Top (isolate 0.178, rank 4): 0,43.18 85.09,43.18 85.09,0 0,0
I2C_!INT  (via drill 0.3, 0.35)
  Top 0.178: v27.81,16.19 27.72,16.09 J6.16 | v39.5,13.72 39.52,13.69 v39.52,11.56
  Bottom 0.178: v27.81,16.19 v27.82,16.19 28.01,16.19 30.74,13.46 39.24,13.46 v39.5,13.72 | v39.52,11.56 39.65,11.68 52.07,11.68 52.43,11.33 64.9,11.33 66.04,10.19 J9.1
I2S_CLK  (via drill 0.3)
  Top 0.178: J6.50 25.02,24.59 v24.99,24.56 | v32.79,34.92 32.82,34.9 v32.82,25.34
  Bottom 0.178: v24.99,24.56 25.4,24.97 27.94,24.97 28.17,24.74 32.22,24.74 v32.82,25.34 | v32.79,34.92 32.79,35.1 32.03,35.87 32.03,40.41 30.53,41.91 J5.4
I2S_SDI  (via drill 0.3)
  Top 0.178: J6.54 27.8,25.59 v27.84,25.55 | v30.91,34.92 30.96,34.87 v30.96,25.34
  Bottom 0.178: v27.84,25.55 27.96,25.43 30.87,25.43 v30.96,25.34 | v30.91,34.92 30.66,35.18 30.66,38.68 29.87,39.47 27.84,39.47 J5.2
I2S_SDO  (via drill 0.3)
  Top 0.178: J6.56 27.41,26.09 27.74,26.42 v27.74,27.15 | v30.05,34.92 30,34.87 v30,27.18
  Bottom 0.178: v27.74,27.15 27.76,27.18 v30,27.18 | v30.05,34.92 29.79,35.18 29.79,38.79 29.46,39.12 25.65,39.12 J5.1
I2S_WS  (via drill 0.3)
  Top 0.178: J6.52 25.56,25.09 v24.97,25.68 | v31.93,34.92 v31.93,25.34
  Bottom 0.178: v24.97,25.68 26.77,25.68 27.25,26.16 31.1,26.16 v31.93,25.34 | v31.93,34.92 31.62,35.23 31.62,38.79 28.5,41.91 J5.3
MISO1  (via drill 0.3)
  Top 0.178: J6.61 16.35,27.34 16,27.69 v14.99,27.69
  Bottom 0.178: v14.99,27.69 14.78,27.89 14.78,39.83 J12.4
MOSI1  (via drill 0.3)
  Top 0.178: J6.59 15.83,26.84 v15.65,27.03
  Bottom 0.178: v15.65,27.03 15.65,28.04 15.24,28.45 J12.3
N$2
  Top 0.178: R10.1 13.82,16.45 JP1.3
N$3
  Top 0.178: R9.2 15.9,17 JP1.1
N$10
  Top 0.178: J1.A5 7.18,11.41 R2.2
N$11
  Top 0.178: J1.B5 7.56,8.41 R3.2
N$14
  Top 0.178: BT1.+ 73.25,41.52 R8.1 75.05,41.79 D6.A
OUT_MEAS
  Top 0.178: MEAS.3 MEAS.1
  pour Top (isolate 0.305, no thermals): 9.04,9.09 9.32,9.09 9.32,8.36 9.91,7.77 9.91,5.59 8.89,5.59 8.89,8.18 9.04,8.33
PWM0  (via drill 0.3)
  Top 0.178: v23.55,33.27 22.8,32.52 22.8,21.92 24.63,20.09 J6.32
  Bottom 0.178: J8.3 60.96,33.53 60.41,32.98 23.84,32.98 v23.55,33.27
PWM1  (via drill 0.3)
  Top 0.178: v20.32,30.84 20.4,30.84 20.87,30.37 20.87,24.3 20.41,23.84 J6.47
  Bottom 0.178: v20.32,30.84 20.32,31.11 23.11,33.91 23.76,33.91 24.29,33.38 57.76,33.38 58.42,34.04 J8.4
RTC_3V  (via drill 0.3)
  Top 0.178: D7.C D6.C 76.08,39.49 75.69,39.88 74.84,39.88 R8.2 74.78,32.87 v73.84,31.93 | J6.72 25.28,30.09 25.15,30.23 25.15,30.86 26.1,31.81 27.72,31.81 v27.76,31.77
  Bottom 0.178: v27.76,31.77 73.69,31.77 v73.84,31.93
RTS1  (via drill 0.3)
  Top 0.178: J6.13 17.6,15.34 v17.55,15.29 | v18.52,37.86 18.78,38.12 34.31,38.12 35.31,39.12 35.31,41.66 J5.6
  Bottom 0.178: v17.55,15.29 v17.56,15.29 18.15,15.88 18.15,17.24 17.9,17.48 17.9,18.16 19.15,19.41 19.15,35.55 19.49,35.9 19.49,36.89 v18.52,37.86
RX1  (via drill 0.3)
  Top 0.178: J6.19 17.7,16.84 v17.53,17.02 | v18.9,36.14 19.99,37.24 38.51,37.24 40.39,39.12 40.39,41.66 J5.8
  Bottom 0.178: v17.53,17.02 17.53,18.29 18.8,19.56 18.8,29.72 18.8,36.04 v18.9,36.14
RX2  (via drill 0.3)
  Top 0.178: J6.20 27.5,17.09 28.12,17.7 v28.12,19.02 | v50.8,22.61 J5.12
  Bottom 0.178: v28.12,19.02 39.85,19.02 42.93,22.1 50.29,22.1 v50.8,22.61
SCL  (via drill 0.3)
  Top 0.178: J6.14 27.77,15.59 v28.04,15.32 | J3.4 v78.72,12.93
  Bottom 0.178: v28.04,15.32 30.43,12.93 v78.72,12.93
SCL1  (via drill 0.3)
  Top 0.178: J6.53 20.06,25.34 v20.24,25.53 | v65.43,8.13 66.57,8.13 71.65,3.05 75.87,3.05 77.19,4.37 J13.4
  Bottom 0.178: v20.24,25.53 20.85,24.92 20.85,24.16 20.57,23.88 20.57,16.76 21.54,15.8 21.54,8.31 23.55,6.3 63.6,6.3 v65.43,8.13
SCLK1  (via drill 0.3)
  Top 0.178: J6.57 16.43,26.34 v16.28,26.19
  Bottom 0.178: v16.28,26.19 16.28,28.22 15.65,28.85 15.65,39.78 J12.2
SD_!CS!  (via drill 0.3)
  Top 0.178: v27.71,29.62 27.68,29.59 J6.70 | J11.CS 77.12,29.43 v76.96,29.59
  Bottom 0.178: v27.71,29.62 27.74,29.59 v76.96,29.59
SD_DAT1  (via drill 0.3)
  Top 0.178: J11.RSV2 76.99,22.83 v76.96,22.86 | v23.77,24.13 23.56,24.35 23.56,27.62 24.52,28.59 J6.66
  Bottom 0.178: v23.77,24.13 23.88,24.13 24.61,23.39 76.43,23.39 v76.96,22.86
SD_DAT2  (via drill 0.3)
  Top 0.178: v77.47,30.48 77.96,30.48 78.01,30.53 J11.RSV1 | v24.26,29.59 24.76,29.09 J6.68 | v24.26,29.59
  Bottom 0.178: v24.26,29.59 24.89,30.23 77.22,30.23 v77.47,30.48
SDA  (via drill 0.3)
  Top 0.178: J6.12 27.33,15.09 v27.94,14.48 | J3.3 v78.75,11.93 v78.74,11.94
  Bottom 0.178: v27.94,14.48 29.84,12.57 78.11,12.57 v78.74,11.94
SDA1  (via drill 0.3)
  Top 0.178: J6.51 20.02,24.84 v20.22,24.64 | v64.75,6.58 64.77,6.6 64.77,8.48 65.05,8.76 65.86,8.76 66.14,8.48 66.73,8.48 71.6,3.61 75.43,3.61 76.19,4.37 J13.3
  Bottom 0.178: v20.22,24.64 20.22,16.43 21.18,15.47 21.18,8.05 23.29,5.94 64.11,5.94 v64.75,6.58
SPI_MISO  (via drill 0.3)
  Top 0.178: J11.DO 77.14,23.93 v76.96,23.75 | J6.64 24.71,28.09 23.94,27.32 23.94,25.16 v24.16,24.94
  Bottom 0.178: v76.96,23.75 24.92,23.75 24.36,24.31 24.36,24.74 v24.16,24.94
SPI_MOSI  (via drill 0.3)
  Top 0.178: J11.DI 76.97,28.33 v76.96,28.32 | J6.62 27.29,27.59 27.69,27.99 v27.69,28.27
  Bottom 0.178: v76.96,28.32 76.78,28.14 27.81,28.14 v27.69,28.27
SPI_SCK  (via drill 0.3)
  Top 0.178: J11.SCLK 76.99,26.13 v76.96,26.16 | J6.60 25.4,27.09 25.04,26.73 v25.04,26.54
  Bottom 0.178: v76.96,26.16 76.61,26.52 25.07,26.52 v25.04,26.54
SWDCK  (via drill 0.3)
  Top 0.178: v23.75,18.03 23.05,17.34 J6.21
  Bottom 0.178: v23.75,18.03 24.38,17.4 28.19,17.4 31.19,14.4 38.58,14.4 38.91,14.73 40.39,14.73 41.15,13.97 50.29,13.97 53.54,17.22 J2.4
SWDIO  (via drill 0.3)
  Top 0.178: J6.23 22.34,17.84 v23.5,19
  Bottom 0.178: v23.5,19 23.14,18.64 23.14,17.8 24.05,16.89 28.19,16.89 31.08,14.01 38.91,14.01 39.26,14.35 39.95,14.35 40.69,13.61 51.41,13.61 J2.2
TX1  (via drill 0.3)
  Top 0.178: J6.17 17.76,16.34 v17.55,16.13 | v18.41,36.85 19.23,37.67 36.14,37.67 37.85,39.37 37.85,41.66 J5.7
  Bottom 0.178: v17.55,16.13 16.84,16.84 16.84,18.34 18.29,19.79 18.29,36.73 v18.41,36.85
TX2  (via drill 0.3)
  Top 0.178: J6.22 26.41,18.28 v27.18,19.05 | v48.26,22.7 J5.11
  Bottom 0.178: v27.18,19.05 27.3,19.05 27.87,19.62 28.36,19.62 28.61,19.38 39.7,19.38 42.85,22.53 48.09,22.53 v48.26,22.7
USB_N  (via drill 0.3)
  Top 0.178: J1.B7 6.99,10.91 v7.11,10.79 7.11,10.16 6.86,9.91 J1.A7 | J6.5 18.82,13.31 v17.07,13.31
  Bottom 0.178: v7.11,10.79 7.87,11.55 15.31,11.55 v17.07,13.31
USB_P  (via drill 0.3)
  Top 0.178: J1.A6 5.2,10.41 v4.95,10.16 4.95,9.65 5.2,9.41 J1.B6 | J6.3 17.89,12.84 v17.09,12.04
  Bottom 0.178: v4.95,10.16 4.99,10.2 7.36,10.2 8.36,11.2 16.25,11.2 v17.09,12.04
USBHOST_N
  Top 0.178: J6.37 14.22,21.34 12.7,22.86 12.7,29.61 11.76,30.55 10.64,30.55 10.14,31.05 J4.D-
USBHOST_P
  Top 0.178: J6.35 14.22,20.84 12.34,22.71 12.34,29.46 12.15,29.66 | J4.D+ 10.14,29.05 11.29,30.19 11.62,30.19 12.15,29.66 | 12.15,29.66
V_USB
  Top 0.406: J1.VBUS2 5.46,7.71 5.2,7.98 3.58,7.98 2.79,8.76 | J1.VBUS1 5.46,12.61 5.2,12.34 2.95,12.34 2.79,12.19
  Top 0.559: 2.79,8.76 2.79,12.19 2.79,15.24 2.36,15.67 F2.1 2.36,19.81 | J4.VBUS 5.31,33.55 1.27,29.51 1.27,20.9 2.36,19.81 | BYP.1 3.45,19.81 2.36,19.81
VIN
  Top 0.178: 13.49,13.08 16.45,13.08 16.45,11.81 | 13.49,13.08 9.69,13.08 | R10.2 13.49,13.08 | R5.2 12.7,8.13 12.95,7.87 16,7.87 16.45,8.32 16.45,11.81 | 16.45,11.81 16.46,11.8 16.46,13.72 17.08,14.34 J6.9
  Top 0.559: C13.1 C1.1 9.31,16.22 7.67,17.86 C2.+ 6.98,17.22 F2.2 5.36,19.33 4.85,19.84 BYP.2
  pour Top (isolate 0.305, no thermals): 9.04,11.23 9.32,11.23 9.32,11.97 9.86,12.5 9.86,14.48 8.79,14.48 8.79,12.04 9.04,11.79
VIN/3  (via drill 0.3)
  Top 0.178: J6.49 15.7,24.34 v15.67,24.31 | JP1.2 14.86,19.36 v15.52,20.02
  Bottom 0.178: v15.67,24.31 15.75,24.23 15.75,20.24 v15.52,20.02

### Text on the board
Bottom: v10
tPlace: + | -
tDocu: Elias Santistevan